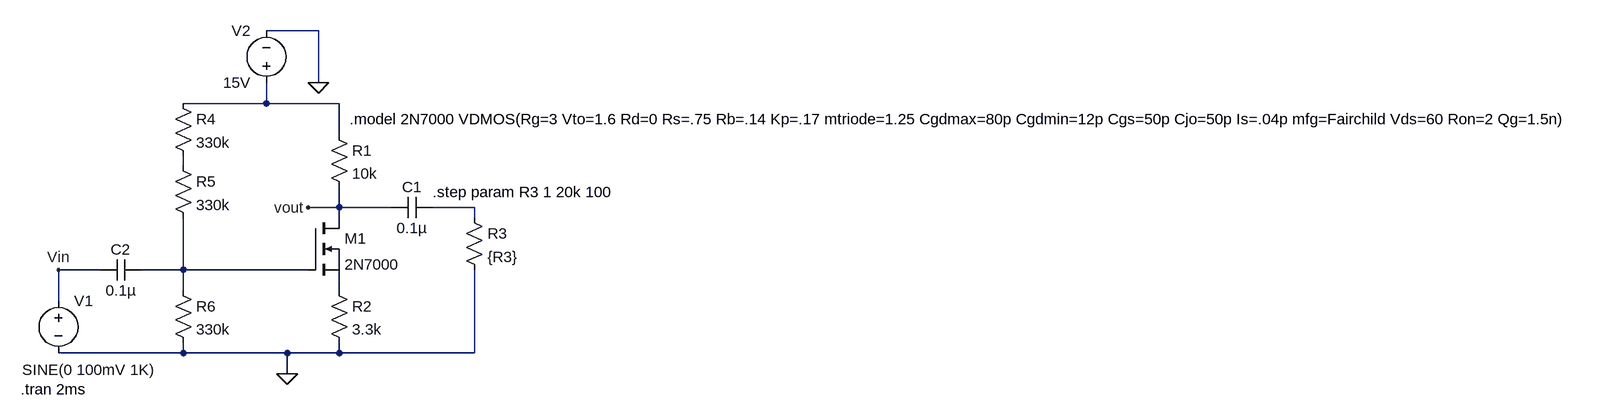
[diagram p0: schematic Draft1.asc]
Draft1.asc, the LTspice schematic file:
Version 4
SHEET 1 2388 680
WIRE 272 -176 192 -176
WIRE 272 -96 272 -176
WIRE 192 -64 192 -96
WIRE 192 -64 64 -64
WIRE 304 -64 192 -64
WIRE 304 -16 304 -64
WIRE 64 32 64 16
WIRE 304 96 304 64
WIRE 304 96 256 96
WIRE 384 96 304 96
WIRE 512 96 448 96
WIRE 304 112 304 96
WIRE 512 112 512 96
WIRE -64 192 -128 192
WIRE 64 192 64 112
WIRE 64 192 0 192
WIRE 256 192 64 192
WIRE 64 224 64 192
WIRE 304 224 304 208
WIRE -128 240 -128 192
WIRE 64 320 64 304
WIRE 64 320 -128 320
WIRE 224 320 64 320
WIRE 304 320 304 304
WIRE 304 320 224 320
WIRE 512 320 512 192
WIRE 512 320 304 320
WIRE 224 352 224 320
FLAG 224 352 0
FLAG 272 -96 0
FLAG -128 192 Vin
FLAG 256 96 vout
SYMBOL nmos 256 112 R0
SYMATTR InstName M1
SYMATTR Value 2N7000
SYMBOL res 288 -32 R0
SYMATTR InstName R1
SYMATTR Value 10k
SYMBOL cap 448 80 R90
WINDOW 0 0 32 VBottom 2
WINDOW 3 32 32 VTop 2
SYMATTR InstName C1
SYMATTR Value 0.1µ
SYMBOL res 288 208 R0
SYMATTR InstName R2
SYMATTR Value 3.3k
SYMBOL res 48 -80 R0
SYMATTR InstName R4
SYMATTR Value 330k
SYMBOL res 48 16 R0
SYMATTR InstName R5
SYMATTR Value 330k
SYMBOL res 48 208 R0
SYMATTR InstName R6
SYMATTR Value 330k
SYMBOL cap 0 176 R90
WINDOW 0 0 32 VBottom 2
WINDOW 3 32 32 VTop 2
SYMATTR InstName C2
SYMATTR Value 0.1µ
SYMBOL voltage -128 224 R0
WINDOW 3 -56 122 Left 2
WINDOW 123 0 0 Left 0
WINDOW 39 0 0 Left 0
SYMATTR InstName V1
SYMATTR Value SINE(0 100mV 1K)
SYMBOL voltage 192 -80 R180
WINDOW 0 24 96 Left 2
WINDOW 3 24 16 Left 2
WINDOW 123 0 0 Left 0
WINDOW 39 0 0 Left 0
SYMATTR InstName V2
SYMATTR Value 15V
SYMBOL res 496 96 R0
SYMATTR InstName R3
SYMATTR Value {R3}
TEXT 320 -40 Left 2 !.model 2N7000 VDMOS(Rg=3 Vto=1.6 Rd=0 Rs=.75 Rb=.14 Kp=.17 mtriode=1.25 Cgdmax=80p Cgdmin=12p Cgs=50p Cjo=50p Is=.04p mfg=Fairchild Vds=60 Ron=2 Qg=1.5n)
TEXT 448 72 Left 2 !.step param R3 1 20k 100
TEXT -186 376 Left 2 !.tran 2ms

The netlist it stands for:
* Draft1.asc
M1 vout N004 N005 N005 2N7000
R1 N001 vout 10k
C1 N003 vout 0.1µ
R2 N005 0 3.3k
R4 N001 N002 330k
R5 N002 N004 330k
R6 N004 0 330k
C2 N004 Vin 0.1µ
V1 Vin 0 SINE(0 100mV 1K)
V2 N001 0 15V
R3 N003 0 {R3}
.model NMOS NMOS
.model PMOS PMOS
.lib standard.mos
.model 2N7000 VDMOS(Rg=3 Vto=1.6 Rd=0 Rs=.75 Rb=.14 Kp=.17 mtriode=1.25 Cgdmax=80p Cgdmin=12p Cgs=50p Cjo=50p Is=.04p mfg=Fairchild Vds=60 Ron=2 Qg=1.5n)
.step param R3 1 20k 100
.tran 2ms
.backanno
.end